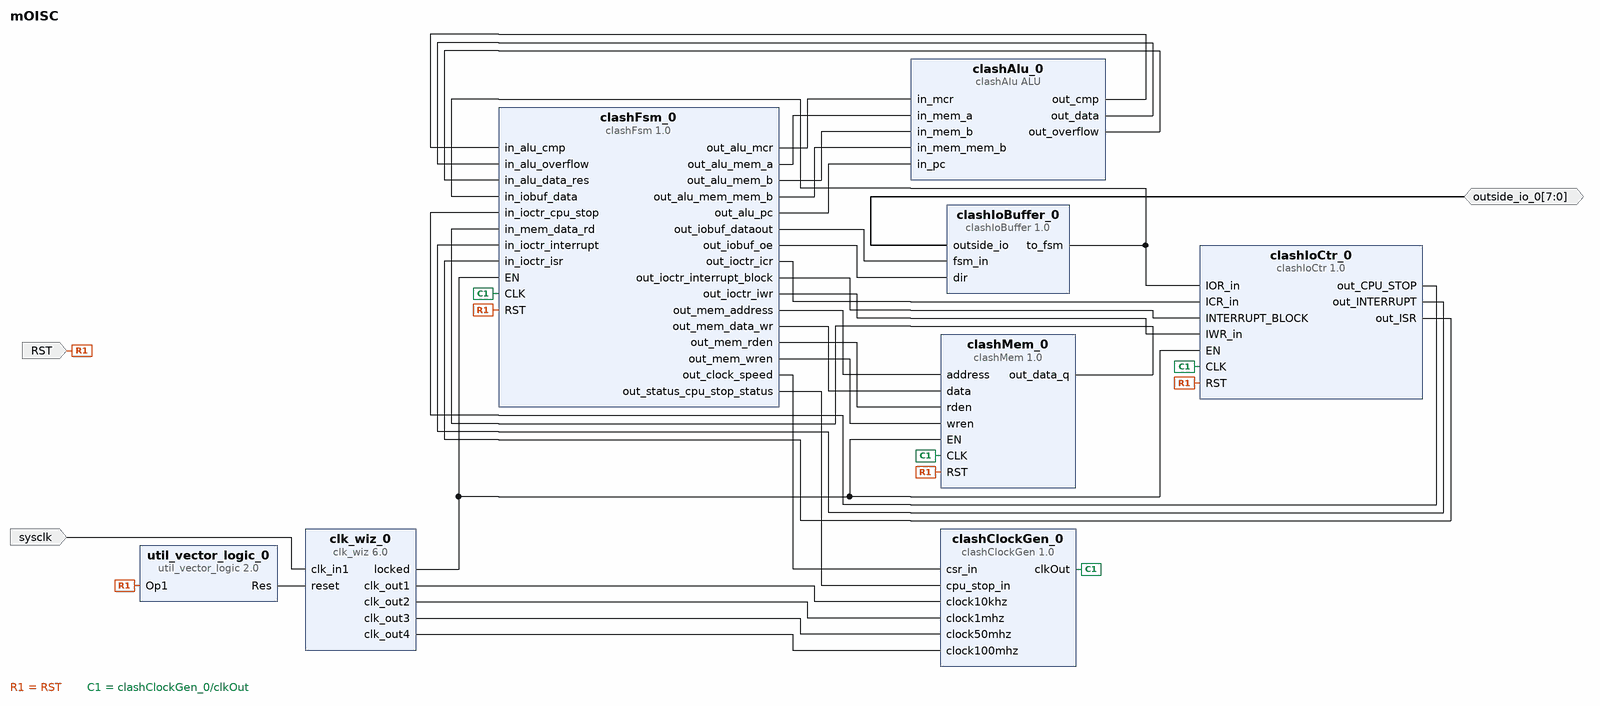
[diagram p0: block diagram of the top level]
# Vivado block design mOISC, xc7z020clg400-1, Vivado 2021.2.1
create_bd_design mOISC

create_bd_port -dir IO -from 7 -to 0 outside_io_0
create_bd_port -dir I -type rst RST
create_bd_port -dir I -type clk sysclk

create_bd_cell -type ip -vlnv cs12.tf.fau.de:mOISCclash:clashAlu:ALU:1.0 clashAlu_0
create_bd_cell -type ip -vlnv cs12.tf.fau.de:mOISCclash:clashIoCtr:1.0 clashIoCtr_0
create_bd_cell -type ip -vlnv cs12.tf.fau.de:mOISCclash:clashMem:1.0 clashMem_0
set_property -dict [list \
  CONFIG.memory_file D:/git/clash-moisc/Vivado/MoiscBlocks/MoiscBlocks.srcs/sources_1/imports/mem/iotest2.clash.bin \
] [get_bd_cells clashMem_0]
create_bd_cell -type ip -vlnv cs12.tf.fau.de:mOISCclash:clashFsm:1.0 clashFsm_0
create_bd_cell -type ip -vlnv cs12.tf.fau.de:mOISCclash:clashIoBuffer:1.0 clashIoBuffer_0
create_bd_cell -type ip -vlnv cs12.tf.fau.de:mOISCclash:clashClockGen:1.0 clashClockGen_0
create_bd_cell -type ip -vlnv xilinx.com:ip:clk_wiz:6.0 clk_wiz_0
set_property -dict [list \
  CONFIG.CLKIN1_JITTER_PS 80.0 \
  CONFIG.CLKOUT1_JITTER 197.700 \
  CONFIG.CLKOUT1_PHASE_ERROR 96.948 \
  CONFIG.CLKOUT1_REQUESTED_OUT_FREQ 10 \
  CONFIG.CLKOUT2_JITTER 197.700 \
  CONFIG.CLKOUT2_PHASE_ERROR 96.948 \
  CONFIG.CLKOUT2_REQUESTED_OUT_FREQ 10 \
  CONFIG.CLKOUT2_USED true \
  CONFIG.CLKOUT3_JITTER 143.688 \
  CONFIG.CLKOUT3_PHASE_ERROR 96.948 \
  CONFIG.CLKOUT3_REQUESTED_OUT_FREQ 50 \
  CONFIG.CLKOUT3_USED true \
  CONFIG.CLKOUT4_JITTER 124.615 \
  CONFIG.CLKOUT4_PHASE_ERROR 96.948 \
  CONFIG.CLKOUT4_USED true \
  CONFIG.CLK_IN1_BOARD_INTERFACE sys_clock \
  CONFIG.MMCM_CLKFBOUT_MULT_F 8.000 \
  CONFIG.MMCM_CLKIN1_PERIOD 8.000 \
  CONFIG.MMCM_CLKOUT0_DIVIDE_F 100.000 \
  CONFIG.MMCM_CLKOUT1_DIVIDE 100 \
  CONFIG.MMCM_CLKOUT2_DIVIDE 20 \
  CONFIG.MMCM_CLKOUT3_DIVIDE 10 \
  CONFIG.NUM_OUT_CLKS 4 \
] [get_bd_cells clk_wiz_0]
create_bd_cell -type ip -vlnv xilinx.com:ip:util_vector_logic:2.0 util_vector_logic_0
set_property -dict {CONFIG.C_OPERATION not CONFIG.C_SIZE 1} [get_bd_cells util_vector_logic_0]

# ---- connections ----

connect_bd_net [get_bd_ports outside_io_0] [get_bd_pins clashIoBuffer_0/outside_io]
connect_bd_net [get_bd_ports RST] \
  [get_bd_pins util_vector_logic_0/Op1] [get_bd_pins clashFsm_0/RST] [get_bd_pins clashIoCtr_0/RST] \
  [get_bd_pins clashMem_0/RST]
connect_bd_net [get_bd_pins clashAlu_0/out_cmp] [get_bd_pins clashFsm_0/in_alu_cmp]
connect_bd_net [get_bd_pins clashAlu_0/out_data] [get_bd_pins clashFsm_0/in_alu_overflow]
connect_bd_net [get_bd_pins clashAlu_0/out_overflow] [get_bd_pins clashFsm_0/in_alu_data_res]
connect_bd_net [get_bd_pins clashClockGen_0/clkOut] [get_bd_pins clashMem_0/CLK] [get_bd_pins clashFsm_0/CLK] [get_bd_pins clashIoCtr_0/CLK]
connect_bd_net [get_bd_pins clashFsm_0/out_alu_mcr] [get_bd_pins clashAlu_0/in_mcr]
connect_bd_net [get_bd_pins clashFsm_0/out_alu_mem_a] [get_bd_pins clashAlu_0/in_mem_a]
connect_bd_net [get_bd_pins clashFsm_0/out_alu_mem_b] [get_bd_pins clashAlu_0/in_mem_b]
connect_bd_net [get_bd_pins clashFsm_0/out_alu_mem_mem_b] [get_bd_pins clashAlu_0/in_mem_mem_b]
connect_bd_net [get_bd_pins clashFsm_0/out_alu_pc] [get_bd_pins clashAlu_0/in_pc]
connect_bd_net [get_bd_pins clashFsm_0/out_clock_speed] [get_bd_pins clashClockGen_0/csr_in]
connect_bd_net [get_bd_pins clashFsm_0/out_iobuf_dataout] [get_bd_pins clashIoBuffer_0/fsm_in]
connect_bd_net [get_bd_pins clashFsm_0/out_iobuf_oe] [get_bd_pins clashIoBuffer_0/dir]
connect_bd_net [get_bd_pins clashFsm_0/out_ioctr_icr] [get_bd_pins clashIoCtr_0/ICR_in]
connect_bd_net [get_bd_pins clashFsm_0/out_ioctr_interrupt_block] [get_bd_pins clashIoCtr_0/INTERRUPT_BLOCK]
connect_bd_net [get_bd_pins clashFsm_0/out_ioctr_iwr] [get_bd_pins clashIoCtr_0/IWR_in]
connect_bd_net [get_bd_pins clashFsm_0/out_mem_address] [get_bd_pins clashMem_0/address]
connect_bd_net [get_bd_pins clashFsm_0/out_mem_data_wr] [get_bd_pins clashMem_0/data]
connect_bd_net [get_bd_pins clashFsm_0/out_mem_rden] [get_bd_pins clashMem_0/rden]
connect_bd_net [get_bd_pins clashFsm_0/out_mem_wren] [get_bd_pins clashMem_0/wren]
connect_bd_net [get_bd_pins clashFsm_0/out_status_cpu_stop_status] [get_bd_pins clashClockGen_0/cpu_stop_in]
connect_bd_net [get_bd_pins clashIoBuffer_0/to_fsm] [get_bd_pins clashFsm_0/in_iobuf_data] [get_bd_pins clashIoCtr_0/IOR_in]
connect_bd_net [get_bd_pins clashIoCtr_0/out_CPU_STOP] [get_bd_pins clashFsm_0/in_ioctr_cpu_stop]
connect_bd_net [get_bd_pins clashIoCtr_0/out_INTERRUPT] [get_bd_pins clashFsm_0/in_ioctr_interrupt]
connect_bd_net [get_bd_pins clashIoCtr_0/out_ISR] [get_bd_pins clashFsm_0/in_ioctr_isr]
connect_bd_net [get_bd_pins clashMem_0/out_data_q] [get_bd_pins clashFsm_0/in_mem_data_rd]
connect_bd_net -net clk_in1_0_1 [get_bd_ports sysclk] [get_bd_pins clk_wiz_0/clk_in1]
connect_bd_net [get_bd_pins clk_wiz_0/clk_out1] [get_bd_pins clashClockGen_0/clock10khz]
connect_bd_net [get_bd_pins clk_wiz_0/clk_out2] [get_bd_pins clashClockGen_0/clock1mhz]
connect_bd_net [get_bd_pins clk_wiz_0/clk_out3] [get_bd_pins clashClockGen_0/clock50mhz]
connect_bd_net [get_bd_pins clk_wiz_0/clk_out4] [get_bd_pins clashClockGen_0/clock100mhz]
connect_bd_net [get_bd_pins clk_wiz_0/locked] [get_bd_pins clashMem_0/EN] [get_bd_pins clashFsm_0/EN] [get_bd_pins clashIoCtr_0/EN]
connect_bd_net [get_bd_pins util_vector_logic_0/Res] [get_bd_pins clk_wiz_0/reset]

validate_bd_design
save_bd_design
